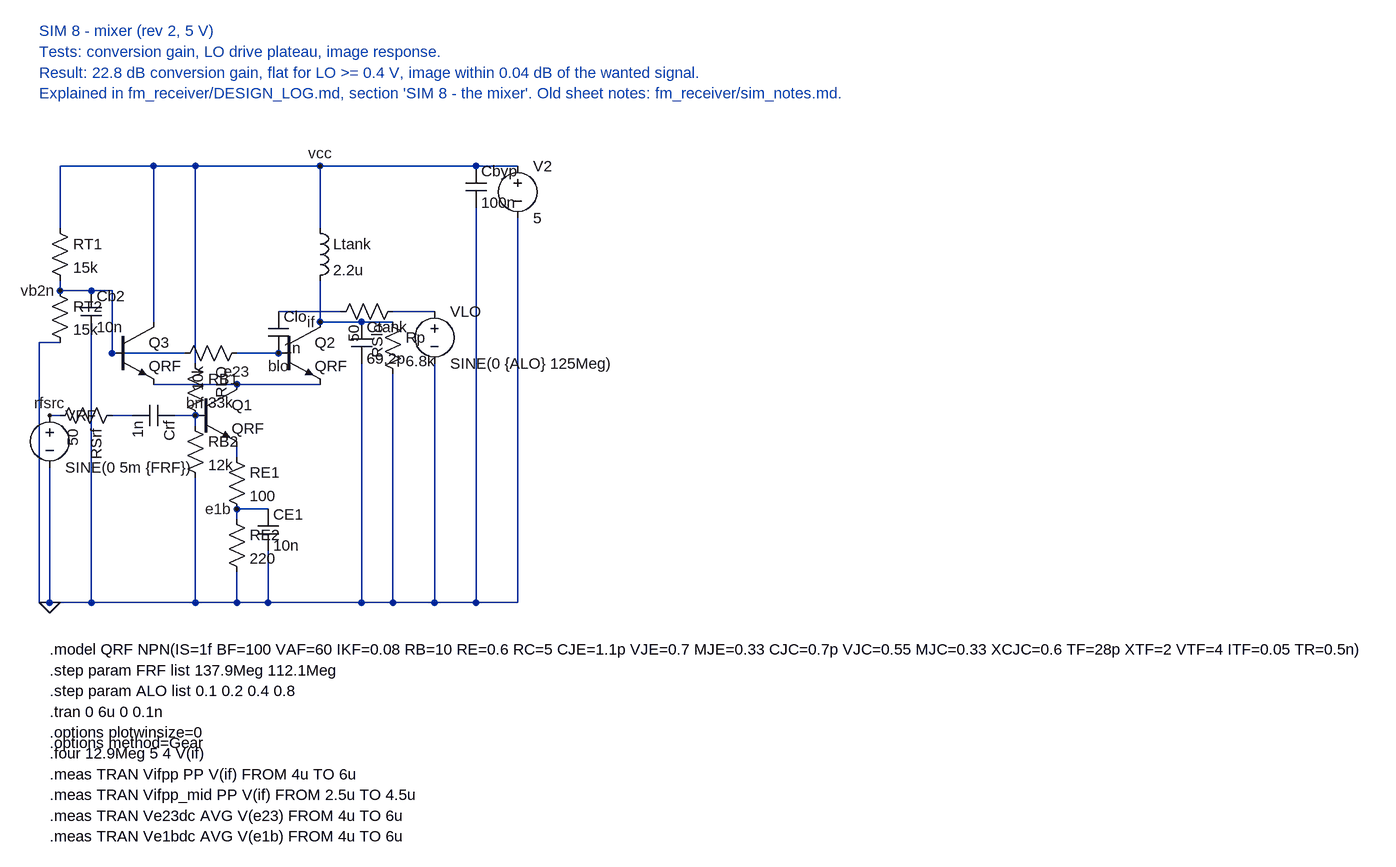
[diagram p0: schematic sim8_mixer.asc]
sim8_mixer.asc, the LTspice schematic file:
Version 4
SHEET 1 1400 1100
WIRE 64 16 208 16
WIRE 208 16 272 16
WIRE 272 16 464 16
WIRE 464 16 704 16
WIRE 704 16 768 16
WIRE 64 112 64 16
WIRE 208 256 208 16
WIRE 272 320 272 16
WIRE 464 112 464 16
WIRE 64 192 64 208
WIRE 64 288 32 288
WIRE 32 288 32 688
WIRE 32 688 48 688
WIRE 64 208 112 208
WIRE 112 208 144 208
WIRE 144 208 144 304
WIRE 112 272 112 688
WIRE 144 304 256 304
WIRE 336 304 400 304
WIRE 400 240 496 240
WIRE 576 240 640 240
WIRE 640 320 640 688
WIRE 464 192 464 256
WIRE 464 256 528 256
WIRE 528 256 576 256
WIRE 528 320 528 688
WIRE 576 336 576 688
WIRE 208 352 336 352
WIRE 336 352 464 352
WIRE 48 400 64 400
WIRE 144 400 176 400
WIRE 240 400 272 400
WIRE 272 400 272 416
WIRE 272 496 272 688
WIRE 336 448 336 464
WIRE 336 544 336 560
WIRE 336 544 384 544
WIRE 336 640 336 688
WIRE 384 608 384 688
WIRE 48 480 48 688
WIRE 48 688 112 688
WIRE 112 688 272 688
WIRE 272 688 336 688
WIRE 336 688 384 688
WIRE 384 688 528 688
WIRE 528 688 576 688
WIRE 576 688 640 688
WIRE 640 688 704 688
WIRE 704 80 704 688
WIRE 768 96 768 688
WIRE 704 688 768 688
FLAG 48 688 0
FLAG 464 16 vcc
FLAG 48 400 rfsrc
FLAG 272 400 brf
FLAG 64 208 vb2n
FLAG 400 304 blo
FLAG 336 352 e23
FLAG 464 256 if
FLAG 336 544 e1b
SYMBOL voltage 48 384 R0
SYMATTR InstName VRF
SYMATTR Value SINE(0 5m {FRF})
SYMBOL res 160 384 R90
SYMATTR InstName RSrf
SYMATTR Value 50
SYMBOL cap 240 384 R90
SYMATTR InstName Crf
SYMATTR Value 1n
SYMBOL res 256 304 R0
SYMATTR InstName RB1
SYMATTR Value 33k
SYMBOL res 256 400 R0
SYMATTR InstName RB2
SYMATTR Value 12k
SYMBOL npn 272 352 R0
SYMATTR InstName Q1
SYMATTR Value QRF
SYMBOL res 320 448 R0
SYMATTR InstName RE1
SYMATTR Value 100
SYMBOL res 320 544 R0
SYMATTR InstName RE2
SYMATTR Value 220
SYMBOL cap 368 544 R0
SYMATTR InstName CE1
SYMATTR Value 10n
SYMBOL res 48 96 R0
SYMATTR InstName RT1
SYMATTR Value 15k
SYMBOL res 48 192 R0
SYMATTR InstName RT2
SYMATTR Value 15k
SYMBOL cap 96 208 R0
SYMATTR InstName Cb2
SYMATTR Value 10n
SYMBOL npn 144 256 R0
SYMATTR InstName Q3
SYMATTR Value QRF
SYMBOL npn 400 256 R0
SYMATTR InstName Q2
SYMATTR Value QRF
SYMBOL res 352 288 R90
SYMATTR InstName RLO
SYMATTR Value 10k
SYMBOL cap 384 240 R0
SYMATTR InstName Clo
SYMATTR Value 1n
SYMBOL res 592 224 R90
SYMATTR InstName RSlo
SYMATTR Value 50
SYMBOL voltage 640 224 R0
SYMATTR InstName VLO
SYMATTR Value SINE(0 {ALO} 125Meg)
SYMBOL ind 448 96 R0
SYMATTR InstName Ltank
SYMATTR Value 2.2u
SYMATTR SpiceLine Rser=1
SYMBOL cap 512 256 R0
SYMATTR InstName Ctank
SYMATTR Value 69.2p
SYMBOL res 560 240 R0
SYMATTR InstName Rp
SYMATTR Value 6.8k
SYMBOL cap 688 16 R0
SYMATTR InstName Cbyp
SYMATTR Value 100n
SYMBOL voltage 768 0 R0
SYMATTR InstName V2
SYMATTR Value 5
TEXT 48 760 Left 2 !.model QRF NPN(IS=1f BF=100 VAF=60 IKF=0.08 RB=10 RE=0.6 RC=5 CJE=1.1p VJE=0.7 MJE=0.33 CJC=0.7p VJC=0.55 MJC=0.33 XCJC=0.6 TF=28p XTF=2 VTF=4 ITF=0.05 TR=0.5n)
TEXT 48 792 Left 2 !.step param FRF list 137.9Meg 112.1Meg
TEXT 48 824 Left 2 !.step param ALO list 0.1 0.2 0.4 0.8
TEXT 48 856 Left 2 !.tran 0 6u 0 0.1n
TEXT 48 888 Left 2 !.options plotwinsize=0
TEXT 48 904 Left 2 !.options method=Gear
TEXT 48 920 Left 2 !.four 12.9Meg 5 4 V(if)
TEXT 48 952 Left 2 !.meas TRAN Vifpp PP V(if) FROM 4u TO 6u
TEXT 48 984 Left 2 !.meas TRAN Vifpp_mid PP V(if) FROM 2.5u TO 4.5u
TEXT 48 1016 Left 2 !.meas TRAN Ve23dc AVG V(e23) FROM 4u TO 6u
TEXT 48 1048 Left 2 !.meas TRAN Ve1bdc AVG V(e1b) FROM 4u TO 6u
TEXT 32 -192 Left 2 ;SIM 8 - mixer (rev 2, 5 V)
TEXT 32 -160 Left 2 ;Tests: conversion gain, LO drive plateau, image response.
TEXT 32 -128 Left 2 ;Result: 22.8 dB conversion gain, flat for LO >= 0.4 V, image within 0.04 dB of the wanted signal.
TEXT 32 -96 Left 2 ;Explained in fm_receiver/DESIGN_LOG.md, section 'SIM 8 - the mixer'. Old sheet notes: fm_receiver/sim_notes.md.

The netlist it stands for:
* sim8_mixer.asc
VRF rfsrc 0 SINE(0 5m {FRF})
RSrf N003 rfsrc 50
Crf brf N003 1n
RB1 vcc brf 33k
RB2 brf 0 12k
Q1 e23 brf N004 0 QRF
RE1 N004 e1b 100
RE2 e1b 0 220
CE1 e1b 0 10n
RT1 vcc vb2n 15k
RT2 vb2n 0 15k
Cb2 vb2n 0 10n
Q3 vcc vb2n e23 0 QRF
Q2 if blo e23 0 QRF
RLO blo vb2n 10k
Clo N001 blo 1n
RSlo N002 N001 50
VLO N002 0 SINE(0 {ALO} 125Meg)
Ltank vcc if 2.2u Rser=1
Ctank if 0 69.2p
Rp if 0 6.8k
Cbyp vcc 0 100n
V2 vcc 0 5
.model NPN NPN
.model PNP PNP
.lib standard.bjt
.model QRF NPN(IS=1f BF=100 VAF=60 IKF=0.08 RB=10 RE=0.6 RC=5 CJE=1.1p VJE=0.7 MJE=0.33 CJC=0.7p VJC=0.55 MJC=0.33 XCJC=0.6 TF=28p XTF=2 VTF=4 ITF=0.05 TR=0.5n)
.step param FRF list 137.9Meg 112.1Meg
.step param ALO list 0.1 0.2 0.4 0.8
.tran 0 6u 0 0.1n
.options plotwinsize=0
.options method=Gear
.four 12.9Meg 5 4 V(if)
.meas TRAN Vifpp PP V(if) FROM 4u TO 6u
.meas TRAN Vifpp_mid PP V(if) FROM 2.5u TO 4.5u
.meas TRAN Ve23dc AVG V(e23) FROM 4u TO 6u
.meas TRAN Ve1bdc AVG V(e1b) FROM 4u TO 6u
* SIM 8 - mixer (rev 2, 5 V)
* Tests: conversion gain, LO drive plateau, image response.
* Result: 22.8 dB conversion gain, flat for LO >= 0.4 V, image within 0.04 dB of the wanted signal.
* Explained in fm_receiver/DESIGN_LOG.md, section 'SIM 8 - the mixer'. Old sheet notes: fm_receiver/sim_notes.md.
.backanno
.end